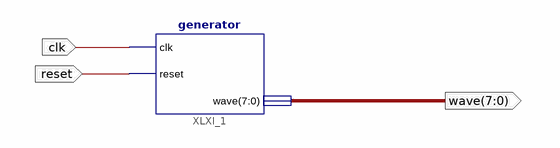
[diagram p0: schematic sheet 1]
// Xilinx ISE schematic MagicKeyboard.sch (spartan3e) as structural Verilog: 1 symbols, 3 ports
module MagicKeyboard (
  input  clk,
  input  reset,
  output [7:0] wave
);

  generator XLXI_1 (.clk(clk), .reset(reset), .wave(wave));
endmodule
